# Altium schematic sheet gauntlet.SchDoc
size C; SheetNumber: 1; SheetTotal: 1
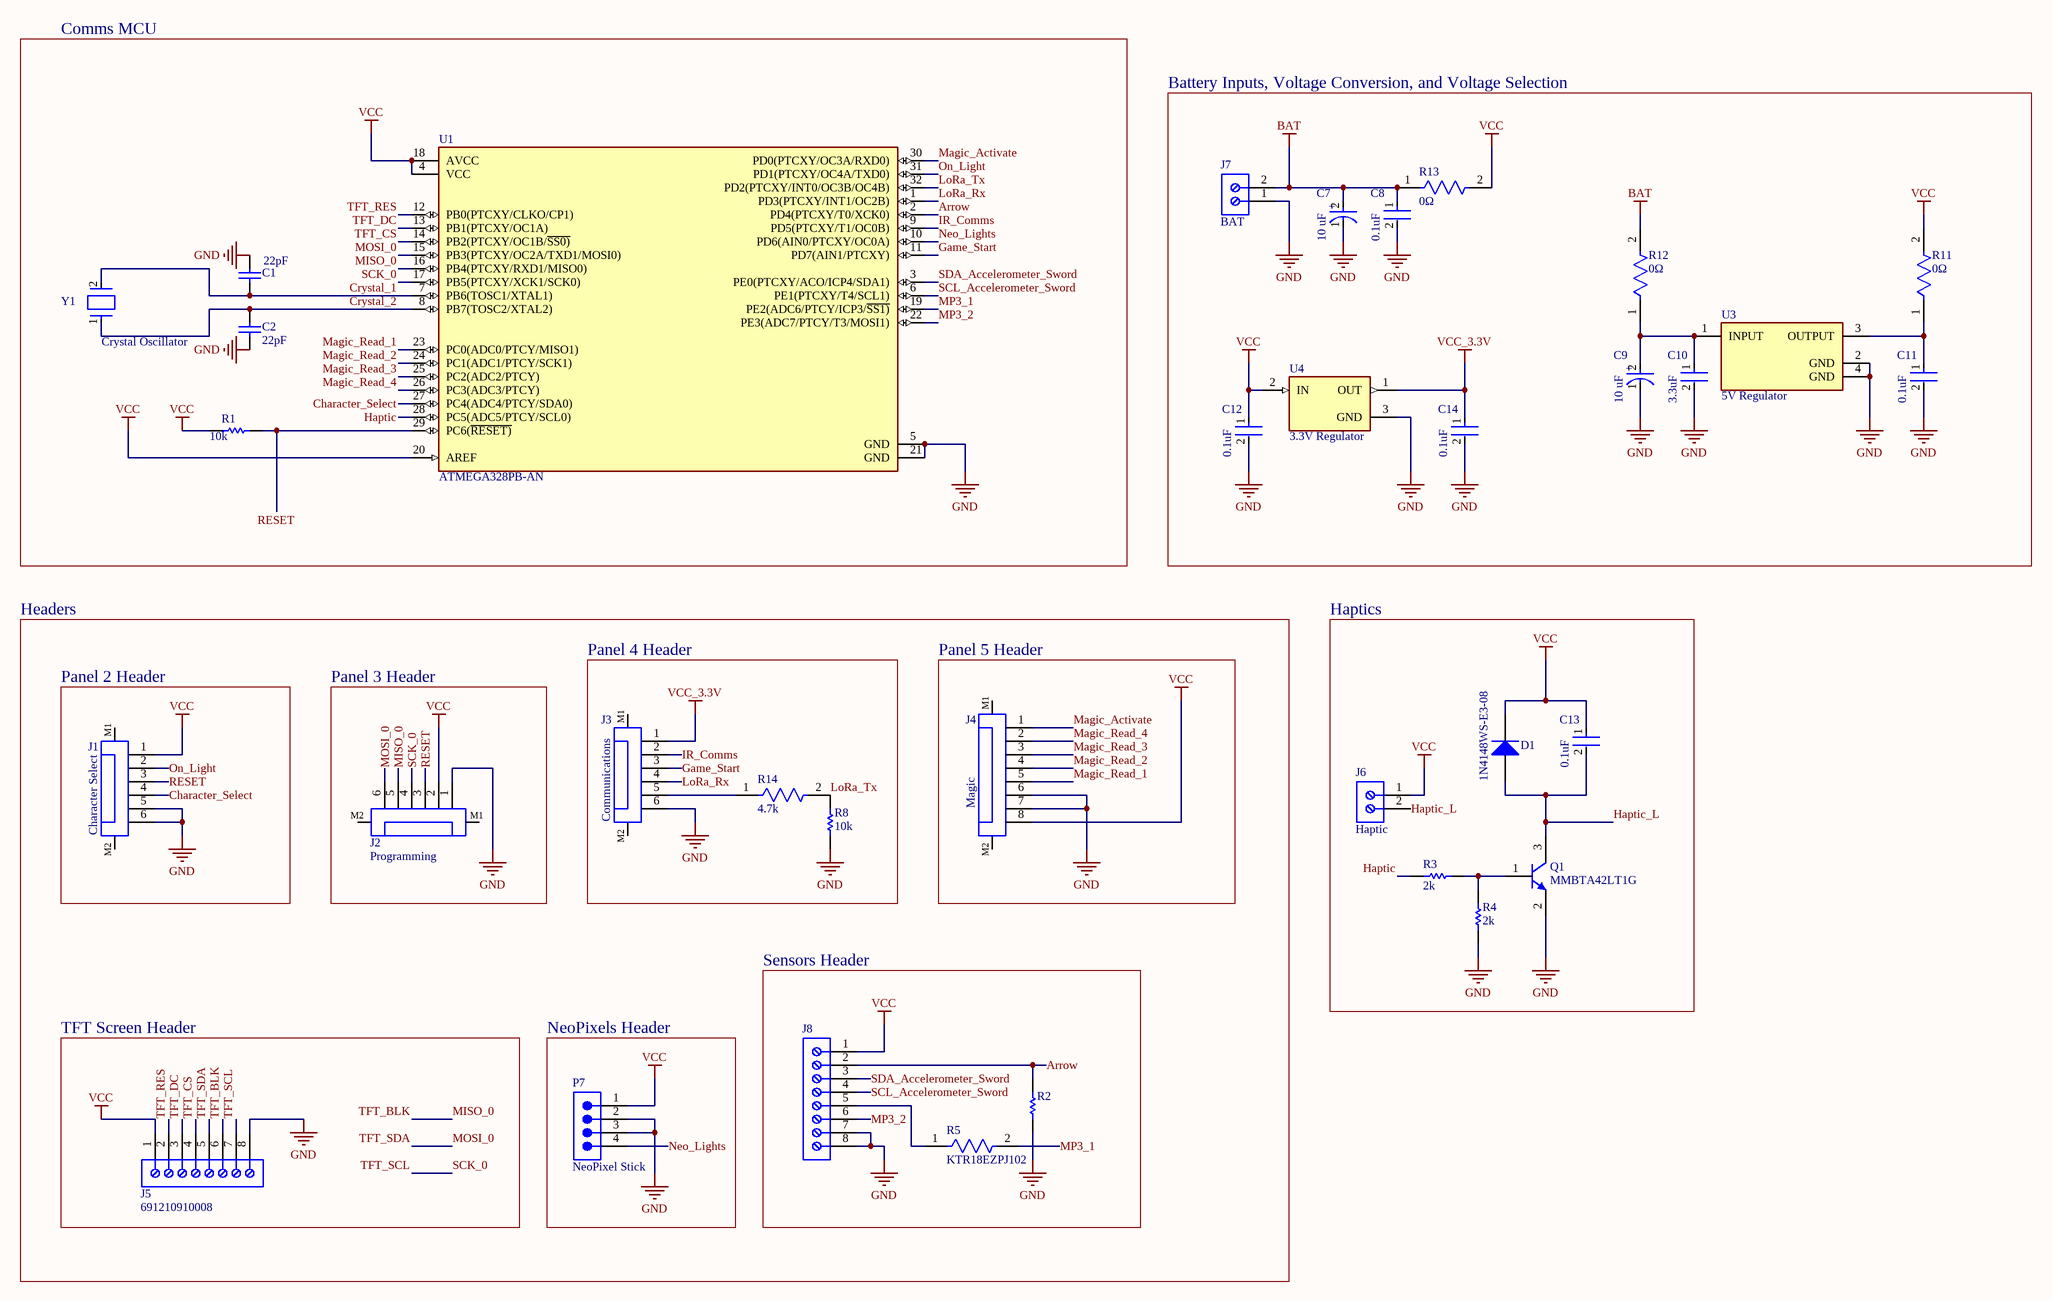
[diagram p0: gauntlet.SchDoc]

## Parts
C1  22pF  [WCAP-CSGP_1206_L3.2W1.6H0.8]
C2  22pF  [WCAP-CSGP_1206_L3.2W1.6H0.8]
C7  10 uF  [FP-FTB-MFG]
C8  0.1uF  [FP-GRM31M-0_15-IPC_A]
C9  10 uF  [FP-FTB-MFG]
C10  3.3uF  [FP-GCG31C-0_3-IPC_B]
C11  0.1uF  [FP-GRM31M-0_15-IPC_A]
C12  0.1uF  [FP-GRM31M-0_15-IPC_A]
C13  0.1uF  [FP-GRM31M-0_15-IPC_A]
C14  0.1uF  [FP-GRM31M-0_15-IPC_A]
D1  1N4148WS-E3-08  [VISH-SOD-323-2_V]
J1  Character Select  [686106183422]
J2  Programming  [686106183422]
J3  Communications  [686106183422]
J4  Magic  [686108183422]
J5  691210910008  [691210910008]
J6  Haptic  [691210910002]
J7  BAT  [691210910002]
J8  (no value)  [691210910008]
P7  NeoPixel Stick  [61300411121]
Q1  MMBTA42LT1G  [ONSC-SOT-23-3-318-08_V]
R1  10k  [RESC3116X65X40ML10T20]
R2  (no value)  [RESC3116X65X40LL10T20]
R3  2k  [RESC3116X65X40LL10T20]
R4  2k  [RESC3116X65X40LL10T20]
R5  KTR18EZPJ102  [FP-KTR18-IPC_A]
R8  10k  [RESC3116X65X40ML10T20]
R11  0Ω  [FP-CR1206-MFG]
R12  0Ω  [FP-CR1206-MFG]
R13  0Ω  [FP-CR1206-MFG]
R14  4.7k  [FP-RT1206-MFG]
U1  ATMEGA328PB-AN  [FP-C04-074-MFG]
U3  5V Regulator  [FP-LM7805MPX-NOPB-MFG]
U4  3.3V Regulator  [FP-DBZ0003A-MFG]
Y1  Crystal Oscillator  [FP-ABM3-MFG]

## Blocks framed on the sheet
Comms MCU: C1 C2 R1 U1 Y1
Battery Inputs, Voltage Conversion, and Voltage Selection: C7-C12 C14 J7 R11-R13 U3 U4
Panel 4 Header: J3 R8 R14
Panel 5 Header: J4
Haptics: C13 D1 J6 Q1 R3 R4
Panel 2 Header: J1
Panel 3 Header: J2
Sensors Header: J8 R2 R5
TFT Screen Header: J5
NeoPixels Header: P7

## Nets
BAT: C7.2(A) C8.1 J7.2 R12.2 R13.1
GND: C1.2 C2.1 C7.1(C) C8.2 C9.1(C) C10.2 C11.2 C12.2 C14.2 J1.5 J1.6 J2.1 J3.6 J4.6 J4.7 J5.8 J7.1 J8.7 J8.8 P7.2 P7.3 Q1.2(E) R2.1 R4.1 R8.1 U1.5(GND) U1.21(GND) U3.2(GND) U3.4(GND) U4.3(GND)
VCC: C12.1 C13.1 D1.2(K) J1.1 J2.2 J4.8 J5.1 J6.1 J8.1 P7.1 R1.1 R11.2 R13.2 U1.4(VCC) U1.18(AVCC) U1.20(AREF) U4.2(IN)
VCC_3.3V: C14.1 J3.1 U4.1(OUT)
Arrow: J8.2 R2.2 U1.2(PD4(PTCXY/T0/XCK0))
Character_Select: J1.4 U1.27(PC4(ADC4/PTCY/SDA0))
Crystal_1: C1.1 U1.7(PB6(TOSC1/XTAL1)) Y1.2
Crystal_2: C2.2 U1.8(PB7(TOSC2/XTAL2)) Y1.1
Game_Start: J3.3 U1.11(PD7(AIN1/PTCXY))
Haptic: R3.2 U1.28(PC5(ADC5/PTCY/SCL0))
Haptic_L: C13.2 D1.1(A) J6.2 Q1.3(C)
IR_Comms: J3.2 U1.9(PD5(PTCXY/T1/OC0B))
LoRa_Rx: J3.4 U1.1(PD3(PTCXY/INT1/OC2B))
LoRa_Tx: R8.2 R14.2 U1.32(PD2(PTCXY/INT0/OC3B/OC4B))
Magic_Activate: J4.1 U1.30(PD0(PTCXY/OC3A/RXD0))
Magic_Read_1: J4.5 U1.23(PC0(ADC0/PTCY/MISO1))
Magic_Read_2: J4.4 U1.24(PC1(ADC1/PTCY/SCK1))
Magic_Read_3: J4.3 U1.25(PC2(ADC2/PTCY))
Magic_Read_4: J4.2 U1.26(PC3(ADC3/PTCY))
MISO_0: J2.5 J5.6 U1.16(PB4(PTCXY/RXD1/MISO0))  [also labelled TFT_BLK]
MOSI_0: J2.6 J5.5 U1.15(PB3(PTCXY/OC2A/TXD1/MOSI0))  [also labelled TFT_SDA]
MP3_1: R5.2 U1.19(PE2(ADC6/PTCY/ICP3/~{SS1)})
MP3_2: J8.6 U1.22(PE3(ADC7/PTCY/T3/MOSI1))
Neo_Lights: P7.4 U1.10(PD6(AIN0/PTCXY/OC0A))
On_Light: J1.2 U1.31(PD1(PTCXY/OC4A/TXD0))
RESET: J1.3 J2.3 R1.2 U1.29(PC6(~{RESET)})
SCK_0: J2.4 J5.7 U1.17(PB5(PTCXY/XCK1/SCK0))  [also labelled TFT_SCL]
SCL_Accelerometer_Sword: J8.4 U1.6(PE1(PTCXY/T4/SCL1))
SDA_Accelerometer_Sword: J8.3 U1.3(PE0(PTCXY/ACO/ICP4/SDA1))
TFT_CS: J5.4 U1.14(PB2(PTCXY/OC1B/~{SS0)})
TFT_DC: J5.3 U1.13(PB1(PTCXY/OC1A))
TFT_RES: J5.2 U1.12(PB0(PTCXY/CLKO/CP1))
NetC9_2: C9.2(A) C10.1 R12.1 U3.1(INPUT)
NetC11_1: C11.1 R11.1 U3.3(OUTPUT)
NetJ3_5: J3.5 R14.1
NetJ8_5: J8.5 R5.1
NetQ1_1: Q1.1(B) R3.1 R4.2

Not connected (* = marked no-connect by the designer): J1 M1 M2; J2 M1 M2; J3 M1 M2; J4 M1 M2

## Notes on the sheet
- Headers
- (in symbol CMP-05427-000035-1) +

## Library data of the parts
C1 C2 = CMP-03913-65419648-1: 885012008002 WCAP-CSGP 1206 (3216Metric) Ceramic Capacitor 0.126Lx0.063W 3.20mmx1.60mm C0G NP0 ±5% 22pF; Insulation Resistance: 10GΩ; Voltage Rating: 10V; Height: 800µm; Tolerance: 5%; Thickness: 889µm; Case Code (Imperial): 1206; Capacitance: 22pF; Max Operating Temperature: 125°C; Min Operating Temperature: -55°C; Width: 1.6mm; Mount: Surface Mount; Case/Package: 1206; Voltage Rating (DC): 10V; NexarPartId: 65419648; Case Code (Metric): 3216; RoHS: Compliant; Length: 3.2mm
C7 C9 = CMP-05427-000035-1: CAP ALUM 10UF 20% 50V SMD; Lead Diameter: 0.65mm; Ripple Current (AC): 85mA; Leakage Current: 5uA; Life (Hours): 2000Hour; Dielectric Material: Aluminium; ESR (Equivalent Series Resistance): 2.3R; Termination: SMD/SMT; Diameter: 4mm; Mount: Surface Mount; Lead Pitch: 1mm; Length: 5.8mm; Min Operating Temperature: -55°C; Capacitance: 10uF; Voltage Rating: 50V; RoHS Compliant: Yes; Package Quantity: 1; Voltage: 50V; Lead Free: Lead Free; Tolerance: 20%; Contact Plating: Tin; Ripple Current: 85mA; Radiation Hardening: No; Max Operating Temperature: 105°C; Series: FT; Voltage Rating (DC): 50V; Number of Pins: 2; Case/Package: Radial; Construction: Cylindrical; Height - Seated (Max): 0.24inch; Packaging: Tape and Reel; Height: 5.8mm
C8 C11-C14 = CMP-06035-007547-1: GRM31M1X1H104JA01L / Chip Multilayer Ceramic Capacitors for General Purpose, 1206, 0.10uF, SL, +350/-1000ppm/°C, 5%, 50V; Capacitance: 100nF; Dissipation Factor: 0.025%; Packaging: Tape and Reel; Length: 0.126inch; Case Code (Imperial): 1206; Voltage Rating (DC): 50V; Max Operating Temperature: 125°C; Voltage: 50V; Height: 1.15mm; Width: 0.063inch; Voltage Rating: 50V; Tolerance: 5%; Min Operating Temperature: -55°C; Mount: Surface Mount; Dielectric Material: Ceramic; Termination: SMD/SMT; Depth: 1.6mm; Case Code (Metric): 3216; Case/Package: 1206; Temperature Coefficient: -1000ppm/°C; Thickness: 0.049inch
C10 = CMP-06035-025559-1: GCG31CR71E335JA01K / AgPd Termination Conductive Glue Mounting Chip Multilayer Ceramic Capacitors for Automotive 1206 Package, X7R 15% 25V 3.3uF 5%
D1 = CMP-2000-05517-2: Small Signal Fast Switching Diode, 1.2 V, 350 mA, -55 to 150 degC, 2-Pin SOD-323, RoHS, Tape and Reel; Manufacturer: Vishay; Brand: VishaySemiconductors; Maximum Power Dissipation: 200mW; Recovery Time: 4ns; Forward Voltage Drop: 1.2V; Peak Reverse Voltage: 100V; Maximum Reverse Leakage Current: 100uA; Maximum Diode Capacitance: 4pF; Forward Continuous Current: 150mA; Package Version: Rev. 5, 09/2009; Unit Weight: 0.000152oz; Max Surge Current: 350mA; Mounting Technology: SurfaceMount; Factory Pack Quantity: 3000; Package / Case: SOD-323; Series: 1N4148WS; Product Category: Diodes-GeneralPurpose,Power,Switching; RoHS: Details; Manufacturer URL: http://www.vishay.com/; Operating Temperature Range: -55Cto+150C; Maximum Operating Temperature: +150C; Packaging: Reel; Datasheet URL: http://www.vishay.com/docs/85751/1n4148ws.pdf; Datasheet Version: Rev. 2.0, 05/2013; Product: SwitchingDiodes; Minimum Operating Temperature: -55C; Package URL: http://www.st.com/st-web-ui/static/active/en/resource/technical/document/datasheet/CD00233088.pdf; Mounting Style: SMD/SMT; Package Reference: SOD-323-2; Package Description: 2-Pin Surface Mount Device, Body 1.775 x 1.3 mm, Height 1.15 mm
J1-J3 = CMP-1502-01493-2: 686106183422; NexarPartId: 81848301; Gender: Receptacle; Contact Resistance: 30mΩ; Current Rating: 800mA; Insulation Resistance: 100MΩ; Pitch: 1mm; Operating Supply Voltage: 50V; Number of Pins: 6; Max Operating Temperature: 85°C; Min Operating Temperature: -25°C; Lead Pitch: 1mm; RoHS: Compliant; Packaging: Tape and Reel; Length: 7.1mm; Orientation: Horizontal; Contact Plating: Tin
J4 = CMP-1502-01494-2: 686108183422; NexarPartId: 81848304; Insulation Resistance: 100MΩ; Operating Supply Voltage: 50V; Contact Resistance: 30mΩ; Current Rating: 800mA; Pitch: 1mm; Gender: Receptacle; Min Operating Temperature: -25°C; Max Operating Temperature: 85°C; RoHS: Compliant; Number of Pins: 8; Contact Plating: Tin; Length: 9.1mm; Orientation: Horizontal; Lead Pitch: 1mm; Packaging: Tape and Reel
J5 = CMP-1502-02461-2: NexarPartId: 105950654
J6 J7 = CMP-1502-02456-2: 691210910002; NexarPartId: 105950649; Current Rating: 6A; Voltage Rating: 150V; Number of Contacts: 2; Number of Rows: 1; Contact Material: Tin; Height: 8.7mm; Max Operating Temperature: 105°C; Min Operating Temperature: -40°C
J8 = CMP-1502-02461-2: 691210910008; NexarPartId: 105950654
P7 = CMP-1502-01064-2: 61300411121; NexarPartId: 32855522; Pitch: 2.54mm; Number of Contacts: 4; Contact Resistance: 20mΩ; Gender: Male; Current Rating: 3A; Connector Type: Male Pin; Voltage Rating: 250V; Lead Free: Lead Free; Contact Plating: Gold; Max Operating Temperature: 105°C; Packaging: Bulk; Height: 8.89mm; Orientation: Vertical; Contact Mating Length: 5.9944mm; Contact Material: Copper; Lead Pitch: 2.54mm; Min Operating Temperature: -40°C; Termination: Solder; Color: Black; Number of Rows: 1; REACH SVHC: Unknown; RoHS: Compliant; Mount: Through Hole; Number of Positions: 4; Number of Pins: 4; Operating Supply Voltage: 250V
Q1 = CMP-1048-00662-1: High Voltage Transistor, NPN Silicon, 3-Pin SOT-23, Pb-Free, Tape and Reel; Manufacturer: On Semiconductor; fT Min (MHz): 50; IC Continuous (A): 0.5; ComponentLink1URL: http://www.onsemi.com/; ComponentLink3URL: http://www.onsemi.cn/pub_link/Collateral/318-08.PDF; RoHS: TRUE; ComponentLink2Description: Datasheet; PartNumber: MMBTA42LT1G; Polarity: NPN; DatasheetVersion: Rev. 12; PackageReference: SOT-23-3-318-08; PackageDescription: 3-Pin Small Outline Transistor, Body 2.92 x 1.3 mm, Pitch 0.95 mm; ComponentLink3Description: Package Specification; ComponentLink1Description: Manufacturer URL; Packing: Tape and Reel; PackageVersion: Rev. AP, 11/2009; Mounting Technology: Surface Mount; ComponentLink2URL: http://www.onsemi.cn/pub_link/Collateral/MMBTA42LT1-D.PDF
R1 = CMP-1014-00623-2: Chip Resistor, 10 KOhm, +/- 1%, 0.25 W, -55 to 155 degC, 1206 (3216 Metric), RoHS, Tape and Reel; Manufacturer: Yageo; Voltage Rating: 200V; Resistance: 10KOhm; Temperature Coefficient: 100ppm/degreesC; Power Rating: 250mW; Packaging: TapeandReel; Termination: SMD/SMT; REACH SVHC: Unknown; Tolerance: 1%; Height: 0.55mm; Composition: ThickFilm; Max Operating Temperature: 155degC; Datasheet Version: Rev. 5, 10/2016; Lead Free: LeadFree; Case Code (Metric): 3216; Depth: 1.6mm; Package Quantity: 5000; RoHSCompliant: true; Military Standard: Not; Case/Package: 1206; Case Code (Imperial): 1206; Min Operating Temperature: -55degC; Datasheet URL: http://www.yageo.com/NewPortal/yageodocoutput?fileName=/pdf/R-Chip/PYu-RC_Group_51_RoHS_L_5.pdf; Length: 3.1mm; Manufacturer URL: http://www.yageo.com/; Package Reference: 1206.0; Width: 1.6mm; Package Description: 2-Pin Surface Mount Device, Body 3.1 x 1.6 mm
R2 = CMP-2003-04017-1: RC1206JR-10220RL; Manufacturer: Yageo; Part Number: RC1206JR-10220RL
R3 R4 = CMP-2003-04099-1: RT1206BRD072KL; Manufacturer: Yageo; Part Number: RT1206BRD072KL
R5 = CMP-08839-031408-1: Res Thick Film 1206 1kΩ 5% 0.1W ±200ppm/°C Automotive Paper T/R; Power Rating: 250mW; Resistance: 1kR; Mount: Surface Mount; Length: 0.126inch; Tolerance: 5%; Temperature Coefficient: 200ppm/°C; Width: 0.063inch; RoHS Compliant: Yes; Max Operating Temperature: 155°C; Max Power Dissipation: 250mW; Resistor Type: Thick Film; Number of Terminations: 2; Packaging: Tape and Reel; Case Code (Metric): 3216; Case/Package: 1206; Lead Free: Lead Free; Size Code: 1206; Features: Automotive AEC-Q200; Case Code (Imperial): 1206; Package Quantity: 1; Height: 0.026inch; Series: KTR; Min Operating Temperature: -55°C
R8 = CMP-2003-04020-1: Manufacturer: Yageo; Part Number: RC1206JR-1310KL
R11-R13 = CMP-2000-06118-2: CR1206-J/-000ELF / Thick Film Chip Resistors 1206 0Ω 0.25W 5%; Power Rating: 250mW; Voltage Rating: 200V; Resistance: 0mR; Temperature Coefficient: 500ppm/°C; Military Standard: Not; Max Power Dissipation: 250mW; Case Code (Imperial): 1206; Width: 1.6mm; Case Code (Metric): 3216; Radiation Hardening: No; Termination: SMD/SMT; Height: 0.6mm; Min Operating Temperature: -55°C; Number of Pins: 2; Voltage Rating (DC): 200V; Mount: Surface Mount; Depth: 1.6mm; Length: 3.2mm; Package Quantity: 5000; Tolerance: 5%; Packaging: Tape and Reel; Max Operating Temperature: 155°C; Contact Plating: Tin; Thickness: 610um; Composition: Thick Film; REACH SVHC: No SVHC; Case/Package: 1206
R14 = CMP-2003-04165-2: RT1206BRD074K7L / RES SMD 4.7K OHM 0.1% 1/4W 1206; Manufacturer: Yageo; Value: 4.7KΩ; Tolerance: 0.005; Temperature Coefficient: 25 ppm/°C; Power Rating: 0.25W; Voltage Rating: 200V; ComponentLink2URL: http://www.yageo.com/documents/recent/PYu-RT_1-to-0.01_RoHS_L_9.pdf; Automotive: No; Height: 0.65mm; Series: RT; Temperature Range High: +155°C; Device Class L2: Resistors; Octopart: https://octopart.com/rt1206brd074k7l-yageo-1170071; Device Class L1: Passive Components; Ipc Land Pattern Name: RESC310160X55; Footprint Url: http://www.yageo.com/exep/pages/download/literatures/PYu-R_Mount_10.pdf; Temperature: -55°C to +155°C; ComponentLink2Description: Datasheet; Package: RT1206; Digikey Description: RES SMD 4.7K OHM 0.1% 1/4W 1206; RoHS: TRUE; Device Class L3: Chip SMD Resistors; Composition: Thin Film; Resistance: 4.7KΩ; Mouser Description: Res Thin Film 1206 4.7K Ohm 0.1% 0.25W(1/4W) ±25ppm/C Epoxy Pad SMD T/R; Lead Free: Yes; Temperature Range Low: -55°C; Manufacturer Part Number: RT1206BRD074K7L; Category: Res
U1 = CMP-06276-000029-1: IC MCU 8BIT 32KB FLASH 32TQFP; Manufacturer: Microchip; Nominal Supply Current: 0.06-5.2mA; Core Architecture: AVR; Ram Size: 2KBytes; Interface: I2C,SPI,USART,2-Wire; Number Of I2C Channels: 2; Max Supply Voltage: 5.5V; Frequency: 20MHz; Standoff Height: 0.05mm; Number Of I/Os: 27; Number Of A/D Converters: 1; Memory Size: 32KBytes; Number Of Pwm Channels: 10; Number Of Adc Channels: 8; Data Bus Width: 8bits; Min Supply Voltage: 1.8V; Number Of Timers/Counters: 5; Category: IC; Memory Type: FLASH; Package: C04-074; Lead Free: Yes; Mouser Description: AVR 32KBytes Flash, 1KBytes EEPROM, 2KBytes RAM, w - 20MHZ, TQFP, Extended TEMP, GREEN 5 V; Ipc Land Pattern Name: QFP80P900X900X120-32; Temperature Range Low: -40°C; Manufacturer Part Number: ATMEGA328PB-AN; Number Of Spi Channels: 2; Automotive: No; Footprint Url: https://ww1.microchip.com/downloads/en/DeviceDoc/32L_TQFP_7x7_PT_C04-0074B.pdf; Number Of Uart Channels: 2; Temperature: -40°C to +105°C; Device Class L3: Microcontrollers; Height: 1.2mm; Octopart: https://octopart.com/atmega328pb-an-microchip-77760226; Digikey Description: IC MCU 8BIT 32KB FLASH 32TQFP; RoHS: TRUE; Device Class L1: Integrated Circuits (ICs); Temperature Range High: +105°C; Device Class L2: Embedded Processors and Controllers; ComponentLink2URL: http://www.microchip.com/mymicrochip/filehandler.aspx?ddocname=en589665; ComponentLink2Description: Datasheet; Number Of Cores: 1
U3 = CMP-04917-000022-1: IC REG LINEAR 5V 1.5A SOT223-4 / LM7805; Manufacturer: Texas Instruments; Manufacturer Part Number: LM7805MPX/NOPB; Dropout Voltage: 2V; Output Type: Fixed; Accuracy Percentage: 3%; Nominal Supply Current: 8mA; Standoff Height: 0.02mm; Min Supply Voltage: 7.5V; Number Of Outputs: 1; Max Junction Temp: +150°C; Max Supply Voltage: 30V; Height: 1.8mm; Temperature Range High: +125°C; Device Class L3: Voltage Regulators - Linear; Lead Free: Yes; Digikey Description: IC REG LINEAR 5V 1.5A SOT223-4; Output Current: 1.5A; Automotive: No; Device Class L1: Integrated Circuits (ICs); ComponentLink2Description: Datasheet; Device Class L2: Power Management ICs; Category: IC; Octopart: https://octopart.com/lm7805mpx%2Fnopb-texas+instruments-74629992; Package: SOT223-4; RoHS: TRUE; Output Voltage: 5V; Temperature Range Low: 0°C; Temperature: 0°C to +125°C; ComponentLink2URL: http://www.ti.com/lit/ds/symlink/lm7800.pdf
U4 = CMP-04917-000020-1: TLV76033DBZR / IC REG LINEAR 3.3V 100MA SOT23-3; Manufacturer: Texas Instruments; Output Type: Fixed; Min Supply Voltage: 4.2V; Standoff Height: 0.01mm; Dropout Voltage: 0.9V; Accuracy Percentage: 4%; Max Supply Voltage: 30V; Number Of Outputs: 1; Max Junction Temp: +125°C; Mouser Description: 100-mA, 30-V wide-VIN, fixed-output linear voltage regulator 3-SOT-23 -40 to 125; Temperature Range High: +125°C; Digikey Description: IC REG LINEAR 3.3V 100MA SOT23-3; ComponentLink2Description: Datasheet; Octopart: https://octopart.com/tlv76033dbzr-texas+instruments-84352145; Output Voltage: 3.3V; Temperature: -40°C to +125°C; Device Class L1: Integrated Circuits (ICs); Height: 1.12mm; Category: IC; Device Class L2: Power Management ICs; Package: DBZ0003A; Device Class L3: Voltage Regulators - Linear; Manufacturer Part Number: TLV76033DBZR; RoHS: TRUE; Automotive: No; Output Current: 100mA; ComponentLink2URL: http://www.ti.com/lit/ds/symlink/tlv760.pdf; Lead Free: Yes; Temperature Range Low: -40°C
Y1 = CMP-27762-004490-1: ABM3-16.000MHZ-D2Y-T / Crystal 16MHz ±20ppm 18pF SMD-2 5mm x 3.2mm; Frequency Stability: 30ppm; Series Resistance: 40R; Tolerance: 20ppm; Frequency Tolerance: 20ppm; Load Capacitance: 18pF; Resistor Type: Ceramic; Termination: SMD/SMT; Width: 0.126inch; Mount: Surface Mount; RoHS Compliant: Yes; Package Quantity: 1000; Height: 0.051inch; Length: 0.197inch; Frequency: 16MHz; Operating Frequency: 16 MHz; Packaging: Tape and Reel; Max Operating Temperature: 85°C; Series: ABM3; Case/Package: SMD/SMT; Lead Free: Lead Free; ESR (Equivalent Series Resistance): 40R; Number of Pins: 2; Min Operating Temperature: -40°C